# Altium schematic sheet DOC-6487-3252(Page1).SchDoc: seeeduino nano
size 999 x 999 mm; Date: 3/14/2019 10:04:02 AM; SheetNumber: 1; Origin: Eagle; GateName_1: G$1; SymbolName_1: SEEEDSTUDIO-SCH-FRAME-BIG; LibraryName: moudle-new; DeviceSetName: SEEEDSTUDIO-SCH-FRAME-BIG; Sheet: Sheet:; SeeedStudio: Seeed Studio; Design: Design:; Check: Check:; Vision: Vision:; CC-BY-SA: CC-BY-SA
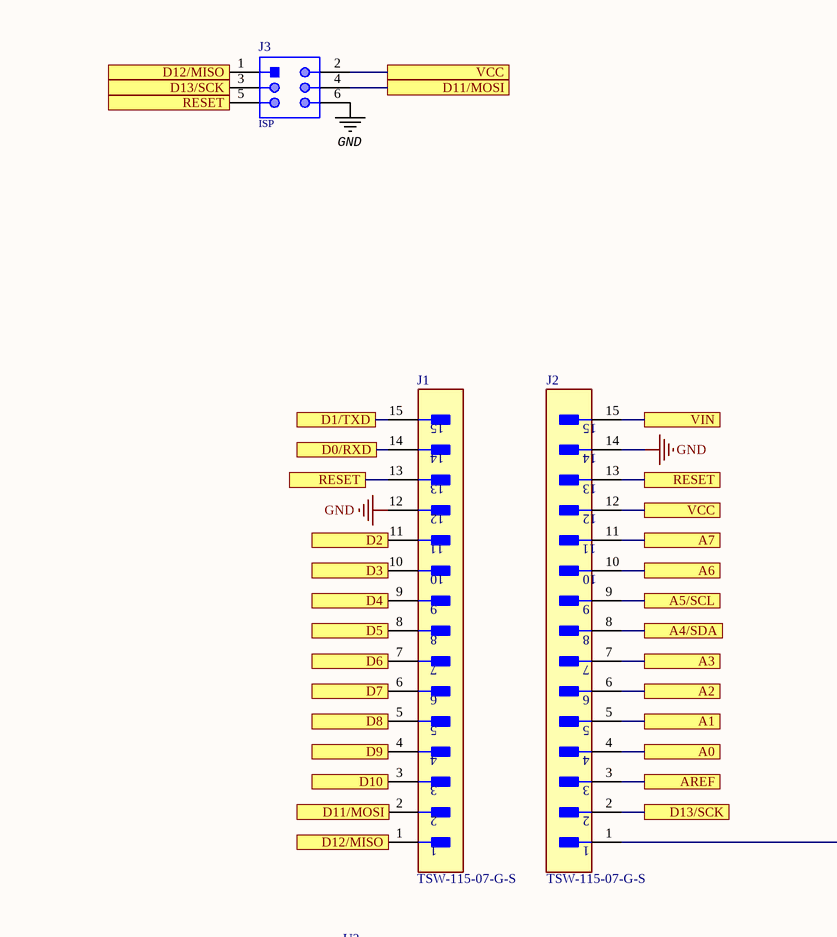
[diagram p0: DOC-6487-3252(Page1).SchDoc, top left]
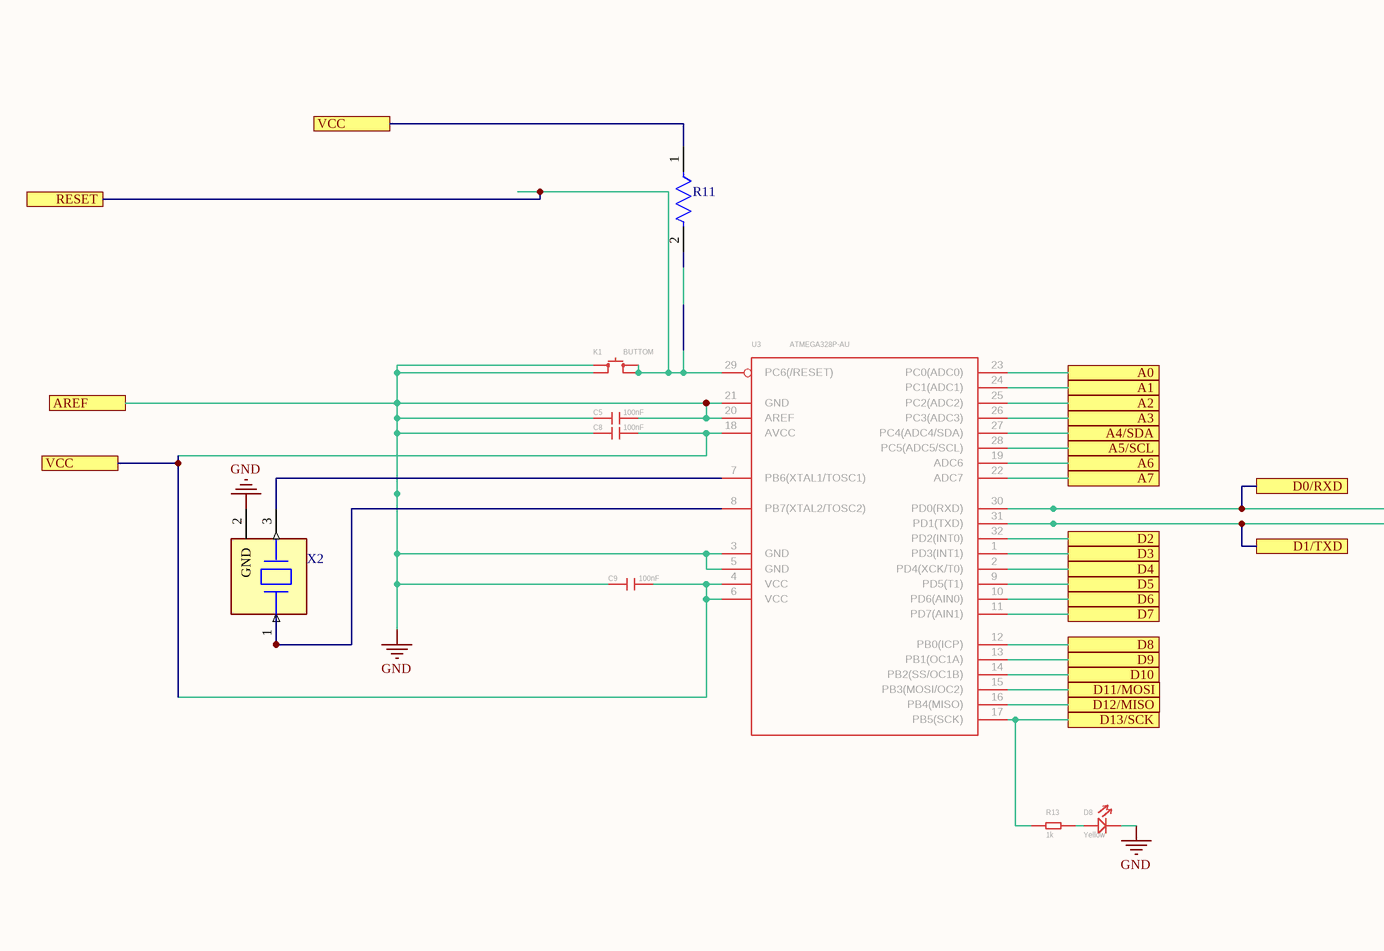
[diagram p1: DOC-6487-3252(Page1).SchDoc, top middle]
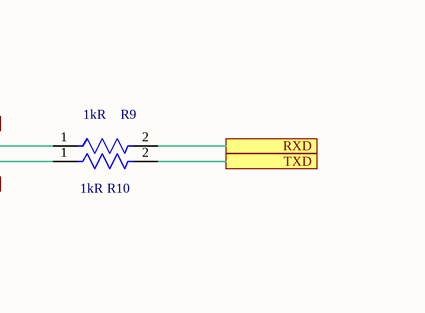
[diagram p2: DOC-6487-3252(Page1).SchDoc, top right]
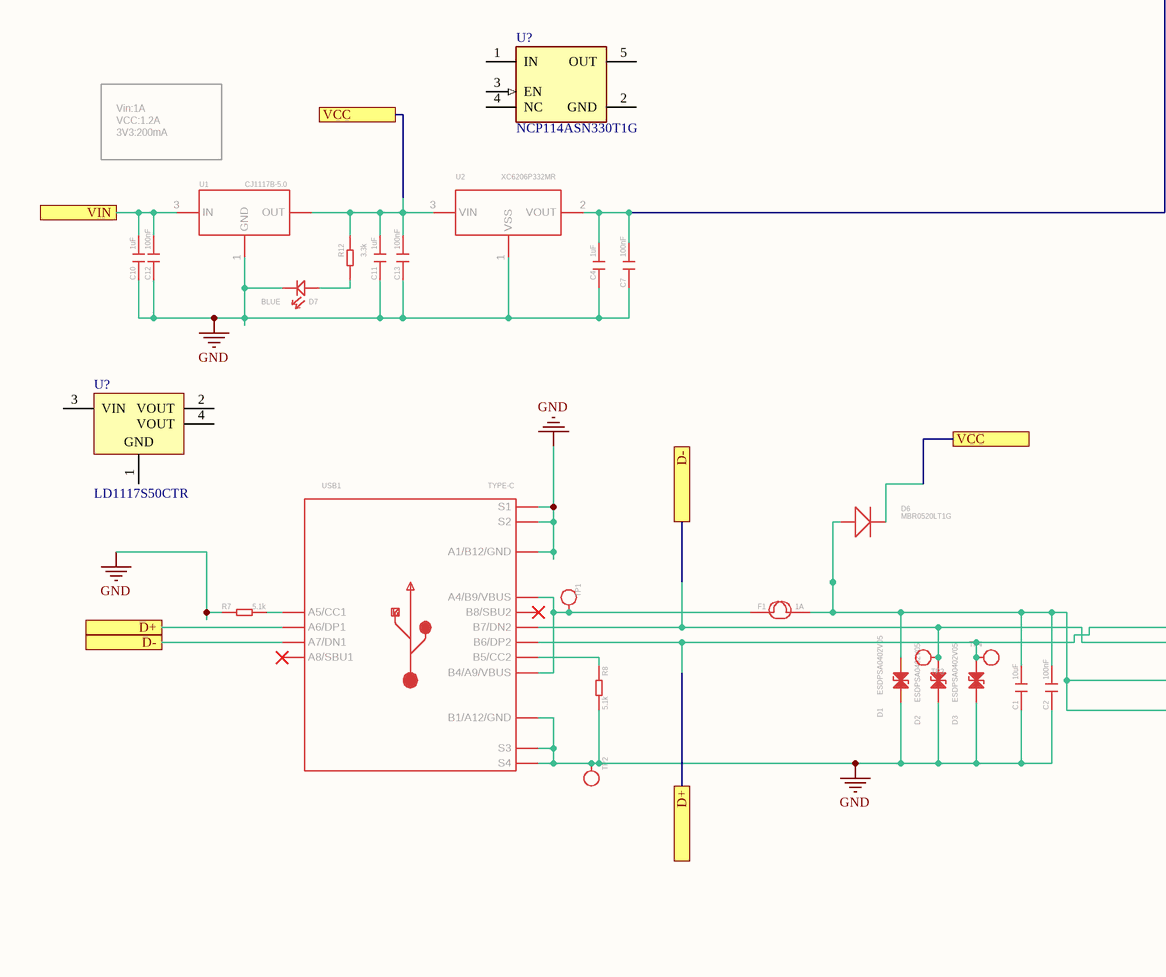
[diagram p3: DOC-6487-3252(Page1).SchDoc, bottom left]
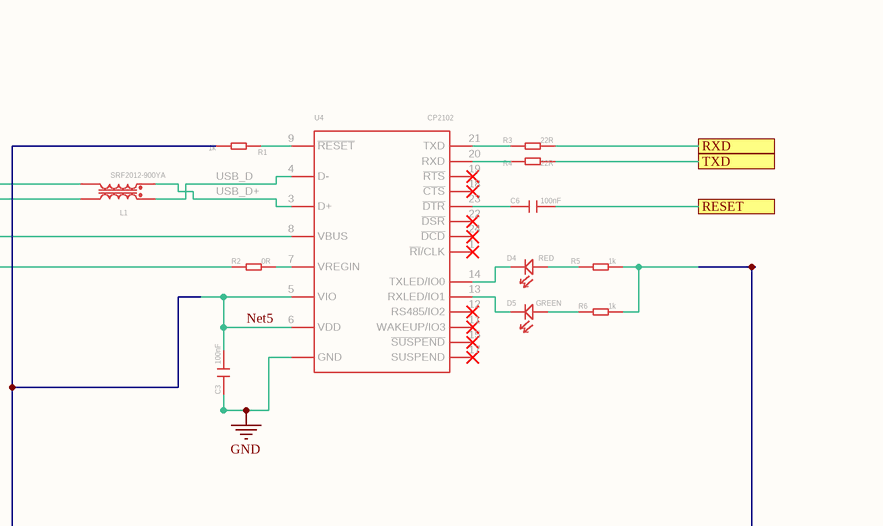
[diagram p4: DOC-6487-3252(Page1).SchDoc, bottom middle]
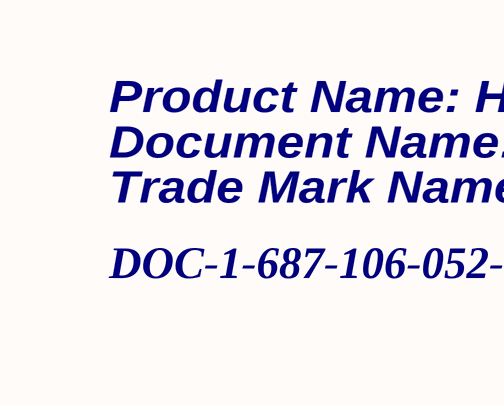
[diagram p5: DOC-6487-3252(Page1).SchDoc, bottom right]

## Parts
(Parts that share a designator on the sheet are numbered #1, #2 ... from top to bottom, then left to right.)
C1  10uF  [C0603]
C2  100nF  [C0603]
C3  100nF  [C0603]
C4  1uF  [C0603]
C5  100nF  [C0603]
C6  100nF  [C0603]
C7  100nF  [C0603]
C8  100nF  [C0603]
C9  100nF  [C0603]
C10  1uF  [C0603]
C11  1uF  [C0603]
C12  100nF  [C0603]
C13  100nF  [C0603]
D1  ESDPSA0402V05  [ESD-0402]
D2  ESDPSA0402V05  [ESD-0402]
D3  ESDPSA0402V05  [ESD-0402]
D4  RED  [LED-0402]
D5  GREEN  [LED-0402]
D6  MBR0520LT1G  [SOD123-2.7X1.6]
D7  BLUE  [LED-0402]
D8  Yellow  [LED-0402]
F1  1A  [F1206]
J1  TSW-115-07-G-S  [FP-TSW-115-07-G-S-MFG]
J2  TSW-115-07-G-S  [FP-TSW-115-07-G-S-MFG]
J3  ISP  [61300621121]
K1  BUTTOM  [SW4P-SMD-4.5X3.2X2.5MM]
L1  SRF2012-900YA  [INT4-0.85-2X1.25X1.2MM]
R1  1k  [R0603]
R2  0R  [R0603]
R3  22R  [R0603]
R4  22R  [R0603]
R5  1k  [R0603]
R6  1k  [R0603]
R7  5.1k  [R0603]
R8  5.1k  [R0603]
R9  Resistance: 1kR  [FP-RK73B1J-IPC_C]  (hidden comment: RK73B1JTTD102J)
R10  Resistance: 1kR  [FP-RK73B1J-IPC_C]  (hidden comment: RK73B1JTTD102J)
R11  RT0603DRE0710KL  [FP-RT0603-IPC_C]  (value not drawn)
R12  3.3k  [R0603]
R13  1k  [R0603]
TP1  TEST  [TP-D45MIL]  (value not drawn)
TP2  TEST  [TP-D45MIL]  (value not drawn)
TP3  TEST  [TP-D45MIL]  (value not drawn)
TP4  TEST  [TP-D45MIL]  (value not drawn)
U1  CJ1117B-5.0  [SOT-223]
U2  XC6206P332MR  [SOT-23]
U3  ATMEGA328P-AU  [TQFP32-0.8-7X7MM]
U4  CP2102  [QFN24G-0.5-4X4MM]
U?#1  NCP114ASN330T1G  [FP-483-MFG]
U?#2  LD1117S50CTR  [SOT-223_L]
USB1  TYPE-C  [USB2.0-TYPE-C]
X2  CSTNE16M0V530000R0  [FP-CSTNE16M0V530000R0-MFG]  (value not drawn)

## Ports
A0, A1, A2, A3, A4/SDA, A5/SCL, A6, A7, AREF, D0/RXD, D1/TXD, D2, D3, D4, D5, D6, D7, D8, D9, D10, D11/MOSI, D12/MISO, D13/SCK, D+, D-, RESET, RXD, TXD, VCC, VIN

## Nets
GND: C1.2 C2.2 C3.2 C4.2 C5.1 C5.2 C7.2 C8.2 C9.2 C10.2 C11.2 C12.2 C13.2 D1.1 D2.1 D3.1 D7.- D8.- J1.12 J2.3 J2.14 J3.6 K1.1(A0) K1.2(A1) R7.1 R8.2 TP2.T U1.1(GND) U2.1(VSS) U3.3(GND) U3.5(GND) U3.20(AREF) U3.21(GND) U4.2_PAD(GND) USB1.A1_B12(A1/B12/GND) USB1.B1_A12(B1/A12/GND) USB1.S1_S5(S1) USB1.S2_S6(S2) USB1.S3 USB1.S4 X2.2(GND) ; port AREF
A0: J2.4 U3.23(PC0(ADC0)) ; port A0
A1: J2.5 U3.24(PC1(ADC1)) ; port A1
A2: J2.6 U3.25(PC2(ADC2)) ; port A2
A3: J2.7 U3.26(PC3(ADC3)) ; port A3
A4/SDA: J2.8 U3.27(PC4(ADC4/SDA)) ; port A4/SDA
A5/SCL: J2.9 U3.28(PC5(ADC5/SCL)) ; port A5/SCL
A6: J2.10 U3.19(ADC6) ; port A6
A7: J2.11 U3.22(ADC7) ; port A7
D0/RXD: J1.14 R9.1 U3.30(PD0(RXD)) ; port D0/RXD
D1/TXD: J1.15 R10.1 U3.31(PD1(TXD)) ; port D1/TXD
D2: J1.11 U3.32(PD2(INT0)) ; port D2
D3: J1.10 U3.1(PD3(INT1)) ; port D3
D4: J1.9 U3.2(PD4(XCK/T0)) ; port D4
D5: J1.8 U3.9(PD5(T1)) ; port D5
D6: J1.7 U3.10(PD6(AIN0)) ; port D6
D7: J1.6 U3.11(PD7(AIN1)) ; port D7
D8: J1.5 U3.12(PB0(ICP)) ; port D8
D9: J1.4 U3.13(PB1(OC1A)) ; port D9
D10: J1.3 U3.14(PB2(SS/OC1B)) ; port D10
D11/MOSI: J3.4 U3.15(PB3(MOSI/OC2)) ; port D11/MOSI
D12/MISO: J1.1 J3.1 U3.16(PB4(MISO)) ; port D12/MISO
D13/SCK: J2.2 J3.3 R13.1 U3.17(PB5(SCK)) ; port D13/SCK
D+: D3.2 L1.3 TP4.T USB1.A6(A6/DP1) USB1.B6(B6/DP2) ; port D+
D-: D2.2 L1.2 TP3.T USB1.A7(A7/DN1) USB1.B7(B7/DN2) ; port D-
Net5: C3.1 R1.1 R5.2 R6.2 U4.5(VIO) U4.6(VDD)
RESET: C6.1 J1.13 J2.13 J3.5 K1.3(B0) K1.4(B1) R11.2 U3.29(PC6(/RESET)) ; port RESET
RXD: R3.2 R9.2 ; port RXD
TXD: R4.2 R10.2 ; port TXD
USB_D: L1.1 U4.4(D-)
USB_D+: L1.4 U4.3(D+)
VCC: C8.1 C9.1 C11.1 C13.1 D6.2(-) J2.12 J3.2 R11.1 R12.1 U1.2_TER(OUT) U2.3(VIN) U3.4(VCC) U3.6(VCC) U3.18(AVCC) ; port VCC
VIN: C10.1 C12.1 J2.15 U1.3(IN) ; port VIN
NetC1_1: C1.1 C2.1 D1.2 D6.1(+) F1.2 R2.1 U4.8(VBUS)
NetC4_1: C4.1 C7.1 J2.1 U2.2(VOUT)
NetC6_2: C6.2 U4.23(~{DTR})
NetD4_+: D4.+ R5.1
NetD4_-: D4.- U4.14(TXLED/IO0)
NetD5_+: D5.+ R6.1
NetD5_-: D5.- U4.13(RXLED/IO1)
NetD7_+: D7.+ R12.2
NetD8_+: D8.+ R13.2
NetF1_1: F1.1 TP1.T USB1.A4_B9(A4/B9/VBUS) USB1.B4_A9(B4/A9/VBUS)
NetR1_2: R1.2 U4.9(~{RESET})
NetR2_2: R2.2 U4.7(VREGIN)
NetR3_1: R3.1 U4.21(TXD)
NetR4_1: R4.1 U4.20(RXD)
NetR7_2: R7.2 USB1.A5(A5/CC1)
NetR8_1: R8.1 USB1.B5(B5/CC2)
NetU3_7: U3.7(PB6(XTAL1/TOSC1)) X2.3(Output)
NetU3_8: U3.8(PB7(XTAL2/TOSC2)) X2.1(Input)

Not connected (* = marked no-connect by the designer): J1 2; U4 1(~{RI}/CLK)* 11(WAKEUP/IO3)* 12(RS485/IO2)* 15(~{SUSPEND})* 17(SUSPEND)* 18(~{CTS})* 19(~{RTS})* 22(~{DSR})* 24(~{DCD})*; U?#1 1(IN) 2(GND) 3(EN) 4(NC) 5(OUT); U?#2 1(GND) 2(VOUT) 3(VIN) 4(VOUT); USB1 A8(A8/SBU1)* B8(B8/SBU2)*

## Notes on the sheet
- Vin:1A
  VCC:1.2A
  3V3:200mA
- Product Name: Hard Node Nano Type
- Document Name: DOC-6487-3252
- Trade Mark Name: Hard Rock Electronics
- DOC-1-687-106-052-133(Page1)

## Library data of the parts
C1 C2 = CAP-0603: Ceramic Capacitors; GateName_1: C; DeviceName: -0603; DeviceSetName: CAP; SymbolName_1: C; LibraryName: Discrete-new
C3-C13 = C*-0603: Ceramic Capacitors; GateName_1: C; DeviceName: -0603; DeviceSetName: C*; SymbolName_1: C; LibraryName: Discrete-small
D1-D3 = D-ESD-2P-DOUBLE-0402: GateName_1: G$1; DeviceName: -0402; SymbolName_1: D-ESD-2P-DOUBLE; LibraryName: Discrete-new; DeviceSetName: D-ESD-2P-DOUBLE
D4 D5 D7 D8 = LED-0402: GateName_1: LED; DeviceName: -0402; SymbolName_1: LED; LibraryName: Discrete-new; DeviceSetName: LED
D6 = D*'MBR0520LT1': GateName_1: D; SymbolName_1: DIODE; DeviceSetName: D*; DeviceName: 'MBR0520LT1'; LibraryName: Discrete-smallsmall
F1 = FUSE'1206': GateName_1: F; SymbolName_1: FUSE; DeviceName: '1206'; LibraryName: Discrete-new; DeviceSetName: FUSE
J1 J2 = CMP-02766-000090-1: CONN HEADER VERT 15POS 2.54MM; Manufacturer: SAMTEC; Conn Gender: Male; Number Of Contacts: 15; Conn Orientation: Vertical; Package: TSW-115-07-G-S; RoHS: TRUE; Manufacturer Part Number: TSW-115-07-G-S; Digikey Description: CONN HEADER VERT 15POS 2.54MM; Device Class L1: Connectors; Temperature Range Low: -55°C; Height: 8.71mm; Contact Material: Gold,Nickel; ComponentLink2URL: http://suddendocs.samtec.com/catalog_english/tsw_th.pdf; ComponentLink2Description: Datasheet; Category: Conn; Footprint Url: http://suddendocs.samtec.com/prints/tsw-xxx-xx-x-x-xx-xxx-footprint.pdf; Lead Free: Yes; Octopart: https://octopart.com/tsw-115-07-g-s-samtec-272210; Pitch: 2.54mm; Device Class L2: Headers and Wire Housings; Temperature: -55°C to +125°C; Number Of Rows: 1; Automotive: No; Device Class L3: unset; Temperature Range High: +125°C
J3 = CMP-1502-01072-1: THT Vertical Pin Header WR-PHD, Pitch 2.54 mm, Dual Row, 6 pins; Manufacturer: Wurth Elektronik; Contact Resistance: 20mOhm; Withstanding Voltage: 500VAC; Pin Number: 6; Gender: Male; Pitch: 2.54mm; Working Voltage: 250VAC; Rated Current: 3A; Packaging: Bag; Row Number: Dual; Manufacturer URL: http://www.we-online.de; Part Number: 61300621121; Operating Temperature: -40to105degC; Mounting Technology: THT; Package Reference: 61300621121; Datasheet URL: https://katalog.we-online.de/em/datasheet/6130xx21121.pdf; Orientation: Vertical; Publisher: WurthElektronik
K1 = BUTTON-4P-4.5X3.2: GateName_1: G$1; SymbolName_1: BOTTON-4P; DeviceName: -4.5X3.2; LibraryName: Switch; DeviceSetName: BUTTON-4P
L1 = INDUCTOR-COMMON-MODE-SRF2012-900YA: GateName_1: G$1; SymbolName_1: INDUCTOR-COMMON-MODE; DeviceName: -SRF2012-900YA; LibraryName: Discrete-new; DeviceSetName: INDUCTOR-COMMON-MODE
R1-R8 R12 R13 = R*-0603: GateName_1: R; DeviceName: -0603; DeviceSetName: R*; SymbolName_1: R; LibraryName: Discrete-small
R9 R10 = CMP-2000-01850-2: RES 1K OHM 5% 1/8W 0603; Power Rating: 100mW; Voltage Rating: 50V; Temperature Coefficient: 200ppm/°C; Case Code (Metric): 1608; Military Standard: Not; Case Code (Imperial): 0603; Termination: SMD/SMT; Package Quantity: 5000; Number of Pins: 2; Voltage Rating (DC): 50V; Construction: Rectangular; Length: 1.6mm; Resistance Tolerance: 5%; Mount: Surface Mount; Case/Package: 0603; Min Operating Temperature: -55°C; Max Operating Temperature: 155°C; Technology: THICK FILM; Series: RK73B; Tolerance: 5%; Depth: 0.8mm; Packaging: Tape and Reel; RoHS Compliant: Yes; Height: 0.45mm; Width: 0.8mm; Resistor Type: Thick Film; Lead Free: Lead Free
R11 = CMP-2000-04608-2: RES SMD 10K OHM 0.5% 1/10W 0603; Manufacturer: Yageo; Tolerance: 0.005; Temperature Coefficient: 50 ppm/°C; Voltage Rating: 75V; Value: 10KΩ; Power Rating: 0.1W; Temperature Range Low: -55°C; ComponentLink2Description: Datasheet; RoHS: TRUE; Manufacturer Part Number: RT0603DRE0710KL; Device Class L1: Passive Components; Octopart: https://octopart.com/rt0603dre0710kl-yageo-1185844; Mouser Description: Thin Film Resistors - SMD 10K ohm 0.5% 1/10W; Automotive: No; Device Class L2: Resistors; Device Class L3: Chip SMD Resistors; Footprint Url: http://www.yageo.com/exep/pages/download/literatures/PYu-R_Mount_10.pdf; Temperature Range High: +155°C; Series: RT; Package: RT0603; Resistance: 10KΩ; Category: Res; Temperature: -55°C to +155°C; Height: 0.55mm; ComponentLink2URL: http://www.yageo.com/documents/recent/PYu-RT_1-to-0.01_RoHS_L_9.pdf; Lead Free: Yes; Composition: Thin Film; Digikey Description: RES SMD 10K OHM 0.5% 1/10W 0603; Ipc Land Pattern Name: RESC16080X45
TP1-TP4 = TEST-POINT'4545': PARTNO: DNP; GateName_1: TP; DeviceName: '4545'; SymbolName_1: TEST-POINT; LibraryName: Discrete-new; DeviceSetName: TEST-POINT
U1 = PMIC-CJ*1117S: Low Drop Fixed And Adjustable Positive Voltage Regulators http://www.datasheetcatalog.org/datasheet/SGSThomsonMicroelectronics/mXuqtqv.pdf; GateName_1: G$1; DeviceName: S; SymbolName_1: PMIC-CJ*1117; LibraryName: IC-new; DeviceSetName: PMIC-CJ*1117
U2 = PMIC-XC6206PMR: LOW ESR Cap.Compatible Positive Voltage Regulators; GateName_1: G$1; DeviceName: MR; SymbolName_1: PMIC-XC6206P; LibraryName: IC-new; DeviceSetName: PMIC-XC6206P
U3 = MCU-ATMEGA8/168/328'AU': GateName_1: G$1; DeviceName: 'AU'; SymbolName_1: MCU-ATMEGA8/168/328; LibraryName: IC-new; DeviceSetName: MCU-ATMEGA8/168/328
U4 = CONVERTER-CP2102N(QFN24): GateName_1: G$1; SymbolName_1: CONVERTER-CP2102N(QFN24); LibraryName: IC-new; DeviceSetName: CONVERTER-CP2102N(QFN24)
U?#1 = CMP-07128-000001-1: IC REG LINEAR 3.3V 300MA 5TSOP; Manufacturer: ON Semiconductor; Dropout Voltage: 150mV; Number Of Outputs: 1; Output Type: Fixed; Standoff Height: 0.01mm; Nominal Supply Current: 50uA; Accuracy Percentage: 1%; Max Junction Temp: +150°C; Min Supply Voltage: 1.7V; Max Supply Voltage: 5.5V; Output Voltage: 3.3V; Device Class L2: Power Management ICs; Digikey Description: IC REG LINEAR 3.3V 300MA 5TSOP; Footprint Url: https://www.onsemi.com/pub/Collateral/483.PDF; Temperature: to +150°C; RoHS: TRUE; Octopart: https://octopart.com/ncp114asn330t1g-on+semiconductor-74628742; Package: 483; Height: 1.1mm; Device Class L1: Integrated Circuits (ICs); Device Class L3: Voltage Regulators - Linear; ComponentLink2URL: https://www.onsemi.com/pub/Collateral/NCP114-D.PDF; Output Current: 300mA; Automotive: No; ComponentLink2Description: Datasheet; Manufacturer Part Number: NCP114ASN330T1G; Category: IC; Lead Free: Yes; Temperature Range High: +150°C
U?#2 = CMP-0244-00311-1: Fixed Low Drop Positive Voltage Regulator, 5V, 4-Pin SOT-223, Tape and Reel; PackageReference: SOT-223; PackageVersion: 2010; ComponentLink2URL: http://www.st.com/internet/com/TECHNICAL_RESOURCES/TECHNICAL_LITERATURE/DATASHEET/CD00000544.pdf; ComponentLink1URL: http://www.st.com; ComponentLink2Description: Datasheet; DatasheetVersion: 1/11/2011; ComponentLink1Description: Manufacturer URL; PackageDescription: 4-Pin SOT-223 Package, 6.5 x 3.5 mm Body, 2.3 mm Pitch, 7 mm Lead Span
USB1 = USB2.0-TYPE-C: GateName_1: USB; SymbolName_1: USB2.0-TYPE-C; LibraryName: Connector-new; DeviceSetName: USB2.0-TYPE-C
X2 = CMP-06054-000001-1: CERAMIC RES 16.0000MHZ 15PF SMD; Manufacturer: Murata; Tolerance: 0.5%; Stability: 0.3%; Frequency: 16MHz; Esr: 40Ω; Lead Free: Yes; ComponentLink2URL: https://www.murata.com/en-sg/products/productdata/8801162231838/SPEC-CSTNE16M0V530000R0.pdf?1545967809000; ComponentLink2Description: Datasheet; Device Class L3: Crystals; Load Capacitance: 15pF; Temperature: -40°C to +85°C; Temperature Range High: +85°C; Series: CSTNE_V; Mouser Description: Ceramic Resonator 16MHz ±0.5% (Tol) ±0.3% (Stability) 15pF 40Ohm 3-Pin CSMD T/R; Automotive: No; RoHS: TRUE; Device Class L2: Crystals / Oscillators; Manufacturer Part Number: CSTNE16M0V530000R0; Package: 0; Category: Crys; Device Class L1: Passive Components; Height: 1mm; Temperature Range Low: -40°C; Digikey Description: CERAMIC RES 16.0000MHZ 15PF SMD; Octopart: https://octopart.com/cstne16m0v530000r0-murata-91406924